# Altium schematic sheet Boost_Converter.SchDoc
size A4; SheetNumber: 1; SheetTotal: 1
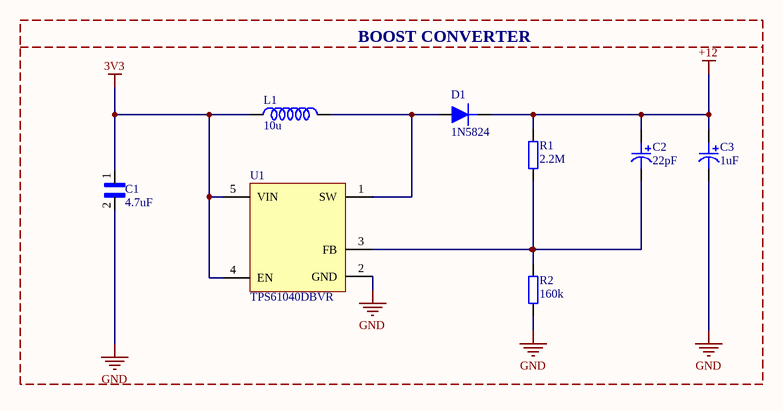
[diagram p0: Boost_Converter.SchDoc]

## Parts
C1  4.7uF  [CAP-0805-NP0]
C2  22pF  [F981C475MMA]
C3  1uF  [F981C475MMA]
D1  1N5824  [SOD323F]
L1  10u  [IND_1212]
R1  2.2M  [RES_0603]
R2  160k  [RES_0603]
U1  TPS61040DBVR  [SOT-23-5]

## Blocks framed on the sheet
BOOST CONVERTER: C1-C3 D1 L1 R1 R2 U1

## Nets
3V3: C1.1 L1.1 U1.4(EN) U1.5(VIN)
+12: C2.1 C3.1 D1.2(K) R1.2
GND: C1.2 C3.2 R2.1 U1.2(GND)
NetC2_2: C2.2 R1.1 R2.2 U1.3(FB)
NetD1_1: D1.1(A) L1.2 U1.1(SW)

## Library data of the parts
C1 = CAP-0805-NP0-10nF: Cap Ceramic 0.01uF 50V C0G 5% Pad SMD 0805 125°C T/R; Manufacturer: Yageo; Manufacturer Part Number: CC0805JKNPO9BN103; Designer: ZehraOzkan; Supplier 1: Newark; RoHS: Yes; Category: Ceramic Capacitors; Stock 1: 12000; Pricing 1: 3000=0,12400, 6000=0,10900, 12000=0,09900, 18000=0,09300, 30000=0,08600 (USD); RoHS Compliant: Yes; Supplier Part Number 1: 50AJ2782
C2 C3 = CAP_0603_16V_Tantalum: Cap Tant Solid 4.7uF 16V M CASE 20%( 1.6 X 0.85 X 0.8mm) Inward L SMD 12 Ohm 125C T/R; Manufacturer: Kyocera AVX; ESR (Equivalent Series Resistance): 12R; Supplier 1: RSComponents; Manufacturer Part Number: F981C475MMA; RoHS: Yes; Category: Tantalum Capacitors; Stock 1: 1; Mount: Surface Mount; Case/Package: 0603; Case Code (Imperial): 0603; Case Code (Metric): 1608; Min Operating Temperature: -55°C; Max Operating Temperature: 125°C; Features: General Purpose; Packaging: Tape and Reel; Capacitance: 4.7uF; Tolerance: 20%; Voltage Rating: 16V; RoHS Compliant: Yes; ComponentLink1URL: http://www.farnell.com/datasheets/2602422.pdf?src-supplier=Farnell; ComponentLink1Description: http://www.farnell.com/datasheets/2602422.pdf?src-supplier=Farnell; ComponentLink2URL: http://www.mouser.com/ds/2/40/AVX_F98%20DTSH%2008_16-974527.pdf?src-supplier=Mouser; ComponentLink2Description: http://www.mouser.com/ds/2/40/AVX_F98%20DTSH%2008_16-974527.pdf?src-supplier=Mouser; ComponentLink3URL: http://datasheets.avx.com/F98.pdf?src-supplier=Digi-Key; ComponentLink3Description: http://datasheets.avx.com/F98.pdf?src-supplier=Digi-Key; ComponentLink4URL: http://www.farnell.com/datasheets/2602422.pdf?src-supplier=Newark; ComponentLink4Description: http://www.farnell.com/datasheets/2602422.pdf?src-supplier=Newark; Supplier Part Number 1: 1361275
D1 = 1N5824: Diode Schottky 30V 5A 2-Pin Axial Leaded Tray; Manufacturer: Microsemi; Forward Voltage: 490mV; Max Reverse Current: 10mA; Peak Non-Repetitive Surge Current: 500A; Element Configuration: Single; Designer: ZehraOzkan; Supplier 1: Newark; Manufacturer Part Number: 1N5824; RoHS: Yes; Category: Rectifier Diodes; Mount: Through Hole; Case/Package: Axial; Number of Pins: 2; Min Operating Temperature: -65°C; Max Operating Temperature: 125°C; Packaging: Bulk; Series: -; Forward Current: 5A; Average Rectified Current: 5A; Max Repetitive Reverse Voltage (Vrrm): 30V; Max Reverse Voltage (DC): 30V; Radiation Hardening: No; RoHS Compliant: Yes; ComponentLink1URL: http://www.microsemi.com/document-portal/doc_download/5865-1n5823-25-pdf?src-supplier=Avnet; ComponentLink1Description: http://www.microsemi.com/document-portal/doc_download/5865-1n5823-25-pdf?src-supplier=Avnet; ComponentLink2URL: https://www.microsemi.com/document-portal/doc_download/5865-1n5823-25-datasheet?src-supplier=Digi-Key; ComponentLink2Description: https://www.microsemi.com/document-portal/doc_download/5865-1n5823-25-datasheet?src-supplier=Digi-Key; ComponentLink3URL: http://www.microsemi.com/datasheets/1N5823-25.PDF?src-supplier=Mouser; ComponentLink3Description: http://www.microsemi.com/datasheets/1N5823-25.PDF?src-supplier=Mouser; Supplier Part Number 1: 34AJ0587
L1 = IND_47uH: Fixed Ind 47UH 390MA 2.3 Ohm SMD; Manufacturer: Wurth Electronics; Manufacturer Part Number: 78438335470; Designer: ZehraOzkan; Core Material: Ferrite; Saturation Current: 1.18A; Shielding: Shielded; DC Resistance (DCR): 2.3R; Self Resonant Frequency: 8MHz; Test Frequency: 100kHz; Tolerance: 30%; Supplier 1: Digi-Key; RoHS: Yes; Category: Fixed Inductors; Stock 1: 15002; Pricing 1: 1=2,11, 50=1,97, 250=1,803, 500=1,672 (USD); Mount: Surface Mount; Case/Package: 1212; Case Code (Metric): 3030; Case Code (Imperial): 1212; Min Operating Temperature: -40°C; Max Operating Temperature: 125°C; Packaging: Cut Tape; Inductance: 47uH; Current Rating: 390mA; Series: WE-MAIA; Length: 0.118inch; Width: 0.118inch; Height - Seated (Max): 0.059inch; Ratings: AEC-Q200; RoHS Compliant: Yes; ComponentLink1URL: https://media.digikey.com/pdf/Data%20Sheets/Wurth%20Electronics%20PDFs/Q+_Products_Flyer.pdf?src-supplier=Digi-Key; ComponentLink1Description: https://media.digikey.com/pdf/Data%20Sheets/Wurth%20Electronics%20PDFs/Q+_Products_Flyer.pdf?src-supplier=Digi-Key; Supplier Part Number 1: 732-6947-1-ND
R1 R2 = RES_0603: Resistor SMD 0603
U1 = TPS61040DBVR: Conv DC-DC 1.8V to 6V Step Up Single-Out 1.8V to 28V 0.4A 5-Pin SOT-23 T/R; Manufacturer: Texas Instruments; Number of Outputs: 1; Output Current: 400mA; Frequency: 1MHz; Efficiency: 86%; Max Output Current: 90mA; Max Supply Current: 50uA; Quiescent Current: 28uA; Topology: Boost; Output Type: Adjustable; Operating Frequency: 1 MHz; Current Rating: 28mA; Output Power: 357mW; Dimming: PWM; Output Current per Channel: 350mA; Supplier 1: Digi-Key; Manufacturer Part Number: TPS61040DBVR; RoHS: Yes; Category: Voltage Regulators - Switching; Stock 1: 5036; Pricing 1: 1=1,65, 10=1,471, 25=1,3956, 100=1,1465, 250=1,07176, 500=0,94712, 1000=0,74773 (USD); Case/Package: SOT-23-5; Number of Pins: 5; Weight: 0.000459oz; Min Operating Temperature: -40°C; Max Operating Temperature: 85°C; Output Voltage: 28V; Packaging: Tape and Reel; Package Quantity: 3000; Max Input Voltage: 6V; Min Input Voltage: 1.8V; High Level Output Current: 90mA; Series: -; Max Supply Voltage: 6V; Min Supply Voltage: 1.8V; Switching Frequency: 1MHz; Min Output Voltage: 1.8V; Max Output Voltage: 28V; Termination: SMD/SMT; Width: 1.6mm; Radiation Hardening: No; Lead Free: Lead Free; RoHS Compliant: Yes; Reach SVHC Compliant: No; ComponentLink1URL: https://datasheet.ciiva.com/27052/1524885-27052324.pdf?src-supplier=Jameco; ComponentLink1Description: https://datasheet.ciiva.com/27052/1524885-27052324.pdf?src-supplier=Jameco; ComponentLink2URL: https://datasheet.ciiva.com/1945/tps61041-1945382.pdf?src-supplier=Digi-Key; ComponentLink2Description: https://datasheet.ciiva.com/1945/tps61041-1945382.pdf?src-supplier=Digi-Key; ComponentLink3URL: https://datasheet.ciiva.com/1945/tps61041-1945381.pdf?src-supplier=Digi-Key; ComponentLink3Description: https://datasheet.ciiva.com/1945/tps61041-1945381.pdf?src-supplier=Digi-Key; ComponentLink4URL: https://datasheet.ciiva.com/1945/tps61041-1945383.pdf?src-supplier=Digi-Key; ComponentLink4Description: https://datasheet.ciiva.com/1945/tps61041-1945383.pdf?src-supplier=Digi-Key; ComponentLink5URL: https://datasheet.ciiva.com/3221/tps61040-3221678.pdf?src-supplier=Avnet; ComponentLink5Description: https://datasheet.ciiva.com/3221/tps61040-3221678.pdf?src-supplier=Avnet; Supplier Part Number 1: 296-12685-1-ND